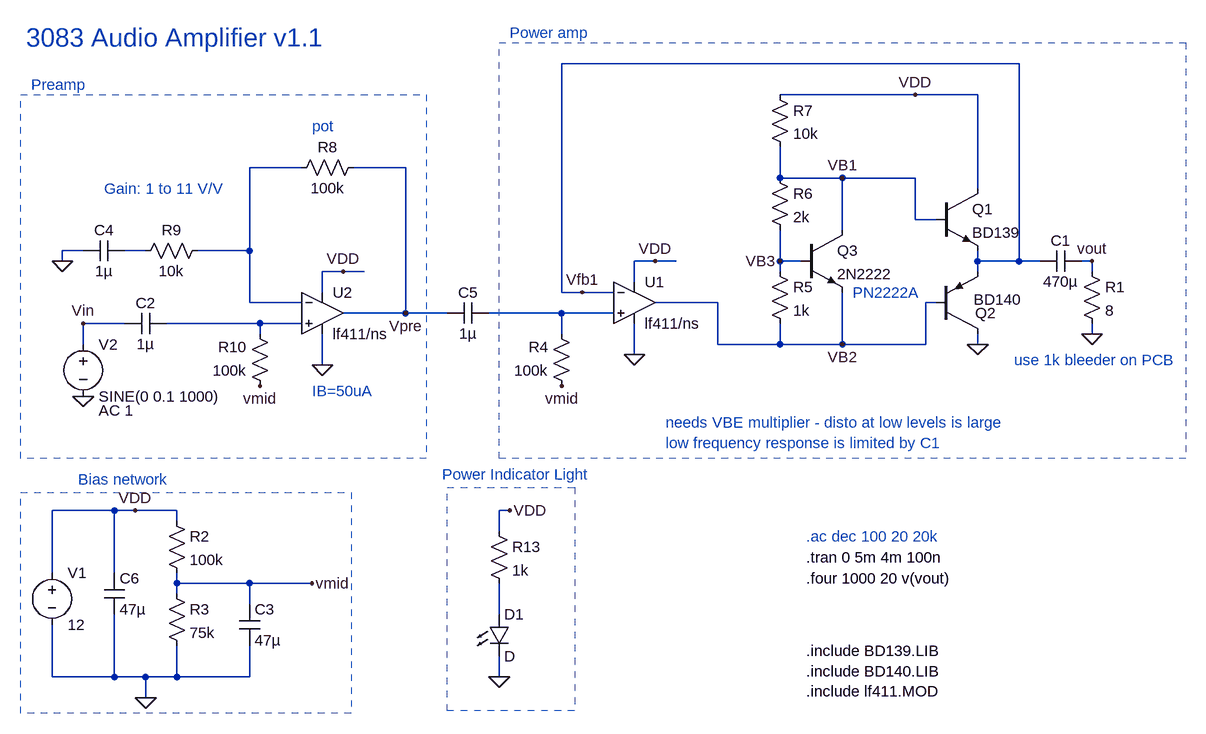
[diagram p0: schematic Audio Amp LTSpice v1.1.asc]
Audio Amp LTSpice v1.1.asc, the LTspice schematic file:
Version 4
SHEET 1 908 1172
WIRE 352 128 -352 128
WIRE 192 176 -16 176
WIRE 288 176 192 176
WIRE -752 288 -832 288
WIRE -592 288 -672 288
WIRE -16 304 -16 256
WIRE 80 304 -16 304
WIRE 192 304 80 304
WIRE 288 320 288 176
WIRE 192 368 192 304
WIRE 224 368 192 368
WIRE 80 384 80 304
WIRE -1088 416 -1120 416
WIRE -992 416 -1024 416
WIRE -832 416 -832 288
WIRE -832 416 -912 416
WIRE -1120 432 -1120 416
WIRE -208 432 -240 432
WIRE -176 432 -208 432
WIRE -16 432 -16 384
WIRE 16 432 -16 432
WIRE 288 432 288 416
WIRE 352 432 352 128
WIRE 352 432 288 432
WIRE 384 432 352 432
WIRE 464 432 448 432
WIRE -688 448 -720 448
WIRE -656 448 -688 448
WIRE -16 448 -16 432
WIRE 288 448 288 432
WIRE 464 448 464 432
WIRE -240 464 -240 432
WIRE -720 480 -720 448
WIRE -352 480 -352 128
WIRE -320 480 -352 480
WIRE -272 480 -320 480
WIRE -832 496 -832 416
WIRE -752 496 -832 496
WIRE -112 496 -208 496
WIRE 224 496 208 496
WIRE -592 512 -592 288
WIRE -592 512 -688 512
WIRE -528 512 -592 512
WIRE -352 512 -464 512
WIRE -272 512 -352 512
WIRE -1024 528 -1088 528
WIRE -816 528 -960 528
WIRE -752 528 -816 528
WIRE -816 544 -816 528
WIRE -352 544 -352 512
WIRE 464 544 464 528
WIRE -1088 560 -1088 528
WIRE -112 560 -112 496
WIRE -16 560 -16 528
WIRE -16 560 -112 560
WIRE 80 560 80 480
WIRE 80 560 -16 560
WIRE 208 560 208 496
WIRE 208 560 80 560
WIRE 288 560 288 544
WIRE -240 576 -240 528
WIRE -720 592 -720 544
WIRE -1040 816 -1136 816
WIRE -1008 816 -1040 816
WIRE -944 816 -1008 816
WIRE -432 816 -448 816
WIRE -944 832 -944 816
WIRE -448 848 -448 816
WIRE -1136 912 -1136 816
WIRE -1040 912 -1040 816
WIRE -944 928 -944 912
WIRE -832 928 -944 928
WIRE -736 928 -832 928
WIRE -944 944 -944 928
WIRE -832 960 -832 928
WIRE -448 976 -448 928
WIRE -1136 1072 -1136 992
WIRE -1040 1072 -1040 976
WIRE -1040 1072 -1136 1072
WIRE -992 1072 -1040 1072
WIRE -944 1072 -944 1024
WIRE -944 1072 -992 1072
WIRE -832 1072 -832 1024
WIRE -832 1072 -944 1072
WIRE -448 1072 -448 1040
WIRE -992 1104 -992 1072
FLAG -240 576 0
FLAG -208 432 VDD
FLAG 288 560 0
FLAG 192 176 VDD
FLAG 464 544 0
FLAG -992 1104 0
FLAG -736 928 vmid
FLAG -1008 816 VDD
FLAG -1088 640 0
FLAG -352 624 vmid
FLAG 464 432 vout
FLAG 80 304 VB1
FLAG 80 560 VB2
FLAG -720 592 0
FLAG -688 448 VDD
FLAG -1120 432 0
FLAG -816 624 vmid
FLAG -592 512 Vpre
FLAG -1088 528 Vin
FLAG -16 432 VB3
FLAG -448 1072 0
FLAG -432 816 VDD
FLAG -320 480 Vfb1
SYMBOL npn 224 320 R0
SYMATTR InstName Q1
SYMATTR Value BD139
SYMATTR Prefix X
SYMBOL pnp 224 544 M180
WINDOW 0 60 32 Left 2
WINDOW 3 58 53 Left 2
SYMATTR InstName Q2
SYMATTR Value BD140
SYMATTR Prefix X
SYMBOL res 448 432 R0
SYMATTR InstName R1
SYMATTR Value 8
SYMBOL cap 448 416 R90
WINDOW 0 0 32 VBottom 2
WINDOW 3 32 32 VTop 2
SYMATTR InstName C1
SYMATTR Value 470µ
SYMBOL res -960 816 R0
SYMATTR InstName R2
SYMATTR Value 100k
SYMBOL res -960 928 R0
SYMATTR InstName R3
SYMATTR Value 75k
SYMBOL voltage -1136 896 R0
SYMATTR InstName V1
SYMATTR Value 12
SYMBOL res -336 640 R180
WINDOW 0 36 76 Left 2
WINDOW 3 36 40 Left 2
SYMATTR InstName R4
SYMATTR Value 100k
SYMBOL cap -960 512 R90
WINDOW 0 0 32 VBottom 2
WINDOW 3 32 32 VTop 2
SYMATTR InstName C2
SYMATTR Value 1µ
SYMBOL voltage -1088 544 R0
WINDOW 123 24 118 Left 2
WINDOW 39 0 0 Left 2
SYMATTR Value2 AC 1
SYMATTR InstName V2
SYMATTR Value SINE(0 0.1 1000)
SYMBOL npn 16 384 R0
SYMATTR InstName Q3
SYMATTR Value 2N2222
SYMBOL res -32 432 R0
SYMATTR InstName R5
SYMATTR Value 1k
SYMBOL res -32 288 R0
SYMATTR InstName R6
SYMATTR Value 2k
SYMBOL cap -848 960 R0
SYMATTR InstName C3
SYMATTR Value 47µ
SYMBOL res -32 160 R0
SYMATTR InstName R7
SYMATTR Value 10k
SYMBOL Opamps/opamp2 -240 432 R0
SYMATTR InstName U1
SYMATTR Value lf411/ns
SYMBOL Opamps/opamp2 -720 448 R0
SYMATTR InstName U2
SYMATTR Value lf411/ns
SYMBOL cap -1024 400 R90
WINDOW 0 0 32 VBottom 2
WINDOW 3 32 32 VTop 2
SYMATTR InstName C4
SYMATTR Value 1µ
SYMBOL res -656 272 R90
WINDOW 0 0 56 VBottom 2
WINDOW 3 32 56 VTop 2
SYMATTR InstName R8
SYMATTR Value 100k
SYMBOL res -896 400 R90
WINDOW 0 0 56 VBottom 2
WINDOW 3 32 56 VTop 2
SYMATTR InstName R9
SYMATTR Value 10k
SYMBOL res -800 640 R180
WINDOW 0 36 76 Left 2
WINDOW 3 36 40 Left 2
SYMATTR InstName R10
SYMATTR Value 100k
SYMBOL cap -464 496 R90
WINDOW 0 0 32 VBottom 2
WINDOW 3 32 32 VTop 2
SYMATTR InstName C5
SYMATTR Value 1µ
SYMBOL cap -1056 912 R0
SYMATTR InstName C6
SYMATTR Value 47µ
SYMBOL LED -464 976 R0
SYMATTR InstName D1
SYMBOL res -464 832 R0
SYMATTR InstName R13
SYMATTR Value 1k
TEXT 24 1032 Left 2 !.include BD139.LIB\n.include BD140.LIB\n.include lf411.MOD
TEXT 24 920 Left 2 !.four 1000 20 v(vout)
TEXT 24 888 Left 2 !.tran 0 5m 4m 100n
TEXT -192 680 Left 2 ;needs VBE multiplier - disto at low levels is large
TEXT 24 856 Left 2 ;.ac dec 100 20 20k
TEXT 96 480 Left 2 ;PN2222A
TEXT -736 224 Left 2 ;pot
TEXT -1168 160 Left 2 ;Preamp
TEXT -432 80 Left 2 ;Power amp
TEXT -1176 88 Left 4 ;3083 Audio Amplifier v1.1
TEXT -736 632 Left 2 ;IB=50uA
TEXT -1096 768 Left 2 ;Bias network
TEXT -1056 320 Left 2 ;Gain: 1 to 11 V/V
TEXT -192 712 Left 2 ;low frequency response is limited by C1
TEXT -536 760 Left 2 ;Power Indicator Light
TEXT 344 584 Left 2 ;use 1k bleeder on PCB
RECTANGLE Normal -560 736 -1184 176 2
RECTANGLE Normal 608 736 -448 96 2
RECTANGLE Normal -1184 788 -676 1128 2
RECTANGLE Normal -528 780 -332 1124 2

The netlist it stands for:
* Audio Amp LTSpice v1.1.asc
XQ1 VDD VB1 Vfb1 BD139  ; pins C B E
XQ2 0 VB2 Vfb1 BD140  ; pins C B E
R1 vout 0 8
C1 vout Vfb1 470µ
R2 VDD vmid 100k
R3 vmid 0 75k
V1 VDD 0 12
R4 vmid N003 100k
C2 N004 Vin 1µ
V2 Vin 0 SINE(0 0.1 1000) AC 1
Q3 VB1 VB3 VB2 0 2N2222
R5 VB3 VB2 1k
R6 VB1 VB3 2k
C3 vmid 0 47µ
R7 VDD VB1 10k
XU1 N003 Vfb1 VDD 0 VB2 lf411/ns  ; pins In+ In- V+ V- OUT
XU2 N004 N001 VDD 0 Vpre lf411/ns  ; pins In+ In- V+ V- OUT
C4 N002 0 1µ
R8 Vpre N001 100k
R9 N001 N002 10k
R10 vmid N004 100k
C5 N003 Vpre 1µ
C6 VDD 0 47µ
D1 N005 0 D
R13 VDD N005 1k
.model D D
.lib standard.dio
.model NPN NPN
.model PNP PNP
.lib standard.bjt
.include BD139.LIB
.include BD140.LIB
.include lf411.MOD
.four 1000 20 v(vout)
.tran 0 5m 4m 100n
* needs VBE multiplier - disto at low levels is large
* .ac dec 100 20 20k
* PN2222A
* pot
* Preamp
* Power amp
* 3083 Audio Amplifier v1.1
* IB=50uA
* Bias network
* Gain: 1 to 11 V/V
* low frequency response is limited by C1
* Power Indicator Light
* use 1k bleeder on PCB
.backanno
.end